# Altium schematic sheet 01-USB Device.SchDoc
size A4; DocumentNumber: 21; SheetNumber: 21; SheetTotal: 34
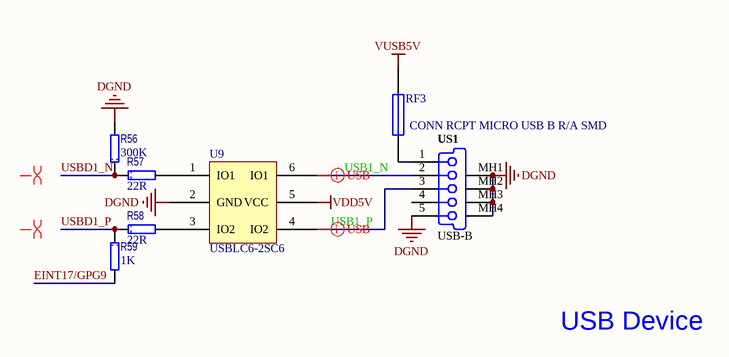
[diagram p0: 01-USB Device.SchDoc]

## Parts
R56  value 300K  [1608[0603]R]  (hidden comment: CRCW0603300KFKEA)
R57  value 22R  [1608[0603]R]  (hidden comment: CRCW060322R0FKEA)
R58  value 22R  [1608[0603]R]  (hidden comment: CRCW060322R0FKEA)
R59  value 1K  [1608[0603]R]  (hidden comment: CRCW06031K00FKEA)
RF3  0805L050WR  [2012[0805]F]  (value not drawn)
U9  USBLC6-2SC6  [SOT26A-6N]
US1  USB-B  Description 1: CONN RCPT MICRO USB B R/A SMD  [USB/SM0.8-6H5]

## Nets
DGND: R56.2 U9.2(GND) US1.5 US1.MH1 US1.MH2 US1.MH3 US1.MH4
VDD5V: U9.5(VCC)
VUSB5V: RF3.2
EINT17/GPG9: R59.2
USB1_N: U9.6(IO1) US1.2
USB1_P: U9.4(IO2) US1.3
USBD1_N: R56.1 R57.1
USBD1_P: R58.1 R59.1
NetR57_2: R57.2 U9.1(IO1)
NetR58_2: R58.2 U9.3(IO2)
NetRF3_1: RF3.1 US1.1

Not connected (* = marked no-connect by the designer): US1 4

## Layout directives
differential pair: (no net found under the mark), USB1_N, USB1_P

## Notes on the sheet
- USB Device

## Library data of the parts
R56 = RES: 厚膜电阻器 - SMD 1/10watt 300Kohms 1%; Manufacturer: Vishay / Dale; 尺寸: 0.85 mm W x 1.55 mm L x 0.45 mm H; 工作温度范围: - 55 C to + 155 C; 封装 / 箱体: 0603 (1608 metric); 封装: Reel; 功率额定值: 100 mW; 产品: Thick Film Resistors SMD; 系列: CRCW; 温度系数: 100 PPM / K; 端接类型: SMD/SMT; 电压额定值: 75 V; 外壳代码 - in: 0603; 外壳代码 - mm: 1608; 制造商: Vishay; 产品种类: 0603 Thick Film Chip Resistors; 标准包装数量: 5000; Supplier 1: Mouser; Supplier Part Number 1: 71-CRCW0603-300K-E3; Manufacturer Part Number: CRCW0603300KFKEA; RoHS: RoHS Compliant By Exemption; Category: 厚膜电阻器 - SMD; Stock 1: 19604; Pricing 1: 1=0.080, 10=0.013, 100=0.010, 1000=0.008, 5000=0.005, 25000=0.004, 50000=0.003 (USD); 电阻: 300 kOhms; 容差: 1 %; RoHS - 贸泽: E; Minimum Order Quantity: 1; Reeling: True; ComponentLink1URL: http://www.mouser.com/ds/2/427/dcrcwe3-109170.pdf; ComponentLink1Description: http://www.mouser.com/ds/2/427/dcrcwe3-109170.pdf; Description 1: 厚膜电阻器 - SMD 1/10watt 300Kohms 1%
R57 R58 = RES: 厚膜电阻器 - SMD 1/10watt 22ohms 1%; Manufacturer: Vishay / Dale; 尺寸: 0.85 mm W x 1.55 mm L x 0.45 mm H; 工作温度范围: - 55 C to + 155 C; 封装 / 箱体: 0603 (1608 metric); 封装: Reel; 功率额定值: 100 mW; 产品: Thick Film Resistors SMD; 系列: CRCW; 温度系数: 100 PPM / K; 端接类型: SMD/SMT; 电压额定值: 75 V; 制造商: Vishay; 标准包装数量: 5000; 外壳代码 - in: 0603; 外壳代码 - mm: 1608; 产品种类: 0603 Thick Film Chip Resistors; Supplier 1: Mouser; Supplier Part Number 1: 71-CRCW0603-22-E3; Manufacturer Part Number: CRCW060322R0FKEA; RoHS: RoHS Compliant By Exemption; Category: 厚膜电阻器 - SMD; Stock 1: 35802; 电阻: 22 Ohms; 容差: 1 %; Minimum Order Quantity: 1; Reeling: True; ComponentLink1URL: http://www.mouser.com/ds/2/427/dcrcwe3-109170.pdf; ComponentLink1Description: http://www.mouser.com/ds/2/427/dcrcwe3-109170.pdf; Description 1: 厚膜电阻器 - SMD 1/10watt 22ohms 1%; Pricing 1: 1=0.080, 10=0.013, 100=0.010, 1000=0.008, 5000=0.005, 25000=0.004, 50000=0.003 (USD); RoHS - 贸泽: E
R59 = RES: 厚膜电阻器 - SMD 1/10watt 1.0Kohms 1%; Manufacturer: Vishay / Dale; 尺寸: 0.85 mm W x 1.55 mm L x 0.45 mm H; 工作温度范围: - 55 C to + 155 C; 封装 / 箱体: 0603 (1608 metric); 封装: Reel; 功率额定值: 100 mW; 产品: Thick Film Resistors SMD; 电阻: 1 kOhms; 系列: CRCW; 温度系数: 100 PPM / K; 端接类型: SMD/SMT; 电压额定值: 75 V; 制造商: Vishay; 产品种类: 0603 Thick Film Chip Resistors; 标准包装数量: 5000; 外壳代码 - in: 0603; 外壳代码 - mm: 1608; Supplier 1: Mouser; Supplier Part Number 1: 71-CRCW0603-1.0K-E3; Manufacturer Part Number: CRCW06031K00FKEA; RoHS: RoHS Compliant By Exemption; Category: 厚膜电阻器 - SMD; Stock 1: 276938; Pricing 1: 1=0.080, 10=0.013, 100=0.010, 1000=0.008, 5000=0.005, 25000=0.004, 50000=0.003 (USD); 容差: 1 %; RoHS - 贸泽: E; Minimum Order Quantity: 1; Reeling: True; ComponentLink1URL: http://www.mouser.com/ds/2/427/dcrcwe3-109170.pdf; ComponentLink1Description: http://www.mouser.com/ds/2/427/dcrcwe3-109170.pdf; Description 1: 厚膜电阻器 - SMD 1/10watt 1.0Kohms 1%
RF3 = FUSE1: 可复位保险丝 PTC 30V POLY SURF MOUNT 0805 .500A; Manufacturer: Littelfuse; Resistance: 850 mOhms; Current Rating (Max): 100 A; Hold Current: 0.5 A; Maximum Voltage: 6 VDC; Trip Current: 1 A; Supplier 1: Mouser; Supplier Part Number 1: 576-0805L050; Manufacturer Part Number: 0805L050WR; RoHS: RoHS Compliant; Category: Resettable Fuses - PPTC; Stock 1: 4103; Pricing 1: 1=3.25, 10=2.61, 50=2.39, 100=2.12, 200=2.07, 500=1.74, 1000=1.49, 3000=1.40, 6000=1.35 (AUD); Dimensions: 2.2 mm L x 1.5 mm W x 1.25 mm  H; Operating Temperature Range: - 40 C to + 85 C; Package / Case: 0805 (2012 metric); Packaging: Reel; Series: 0805L; Termination Style: SMD/SMT; Type: PolyFuse Resettable PTC; Mounting Style: SMD/SMT; Product Category: Resettable PTCs; Standard Pack Qty: 3000; RoHS - Mouser: Y; Minimum Order Quantity: 1; Reeling: True; ComponentLink1URL: http://www.mouser.com/ds/2/240/Littelfuse_0805L-32472.pdf; ComponentLink1Description: http://www.mouser.com/ds/2/240/Littelfuse_0805L-32472.pdf
U9 = USBLC6-2SC6: TVS二极管阵列 ESD Protection Low Cap; Manufacturer: STMicroelectronics; 击穿电压: 6 V; 电容: 3.5 pF; 钳位电压: 17 V; 尺寸: 1.75 (Max) mm W x 3.05 (Max) mm L; 工作电压: 5 V; 封装 / 箱体: SOT-23-6; 封装: Reel; 端接类型: SMD/SMT; 通道: 2 Channels; 峰值浪涌电流: 5 A; 最大工作温度: + 125 C; 最小工作温度: - 40 C; 极性: Bidirectional; 产品种类: Voltage Protection Devices; 标准包装数量: 3000; Supplier 1: Mouser; Supplier Part Number 1: 511-USBLC6-2SC6; Manufacturer Part Number: USBLC6-2SC6; RoHS: RoHS Compliant; Description 1: TVS二极管阵列 ESD Protection Low Cap; Category: TVS二极管阵列; Stock 1: 42706; Pricing 1: 1=0.670, 10=0.590, 100=0.510, 250=0.490, 500=0.460, 1000=0.407, 3000=0.360, 6000=0.321 (USD); 系列: USBLC6-2; 安装风格: SMD/SMT; 制造商: STMicroelectronics; RoHS - 贸泽: Y; Minimum Order Quantity: 1; Reeling: True; ComponentLink1URL: http://www.st.com/web/en/resource/technical/document/datasheet/CD00050750.pdf; ComponentLink1Description: http://www.st.com/web/en/resource/technical/document/datasheet/CD00050750.pdf
US1 = D-300-0034: USB On-The-Go (OTG) Mini-B Receptacle, Right Angle, SMT, 0.80mm (.031") Pitch, Solder Tabs with Back Cover, Recessed Type; Manufacturer: TE Connectivity; Manufacturer Part Number: 1981568-1; Max Current: mA; Number of Contacts: 5; Specifications: USB 1.0; Connector type: Right Angle; Mounting Technology: Surface Mount; Status: Unreleased; Category: Connector; Supplier 1: Digi-Key; Supplier Part Number 1: A97800TR-ND; RoHS: RoHS Compliant; Stock 1: 12000; Pricing 1: 1000=0.9108, 2000=0.88044, 3000=0.85008, 5000=0.80758, 10000=0.78936 (USD); Packaging: Tape & Reel (TR); Gender: Receptacle; Mounting Type: Surface Mount, Right Angle, Horizontal; Features: -; Ingress Protection: -; ComponentLink1URL: http://www.te.com/commerce/DocumentDelivery/DDEController?Action=srchrtrv&DocNm=1981568&DocType=Customer+Drawing&DocLang=English; ComponentLink1Description: http://www.te.com/commerce/DocumentDelivery/DDEController?Action=srchrtrv&DocNm=1981568&DocType=Customer+Drawing&DocLang=English